# EAGLE design IMU_BNO055+BMP280_ui (EAGLE 9.6.2)
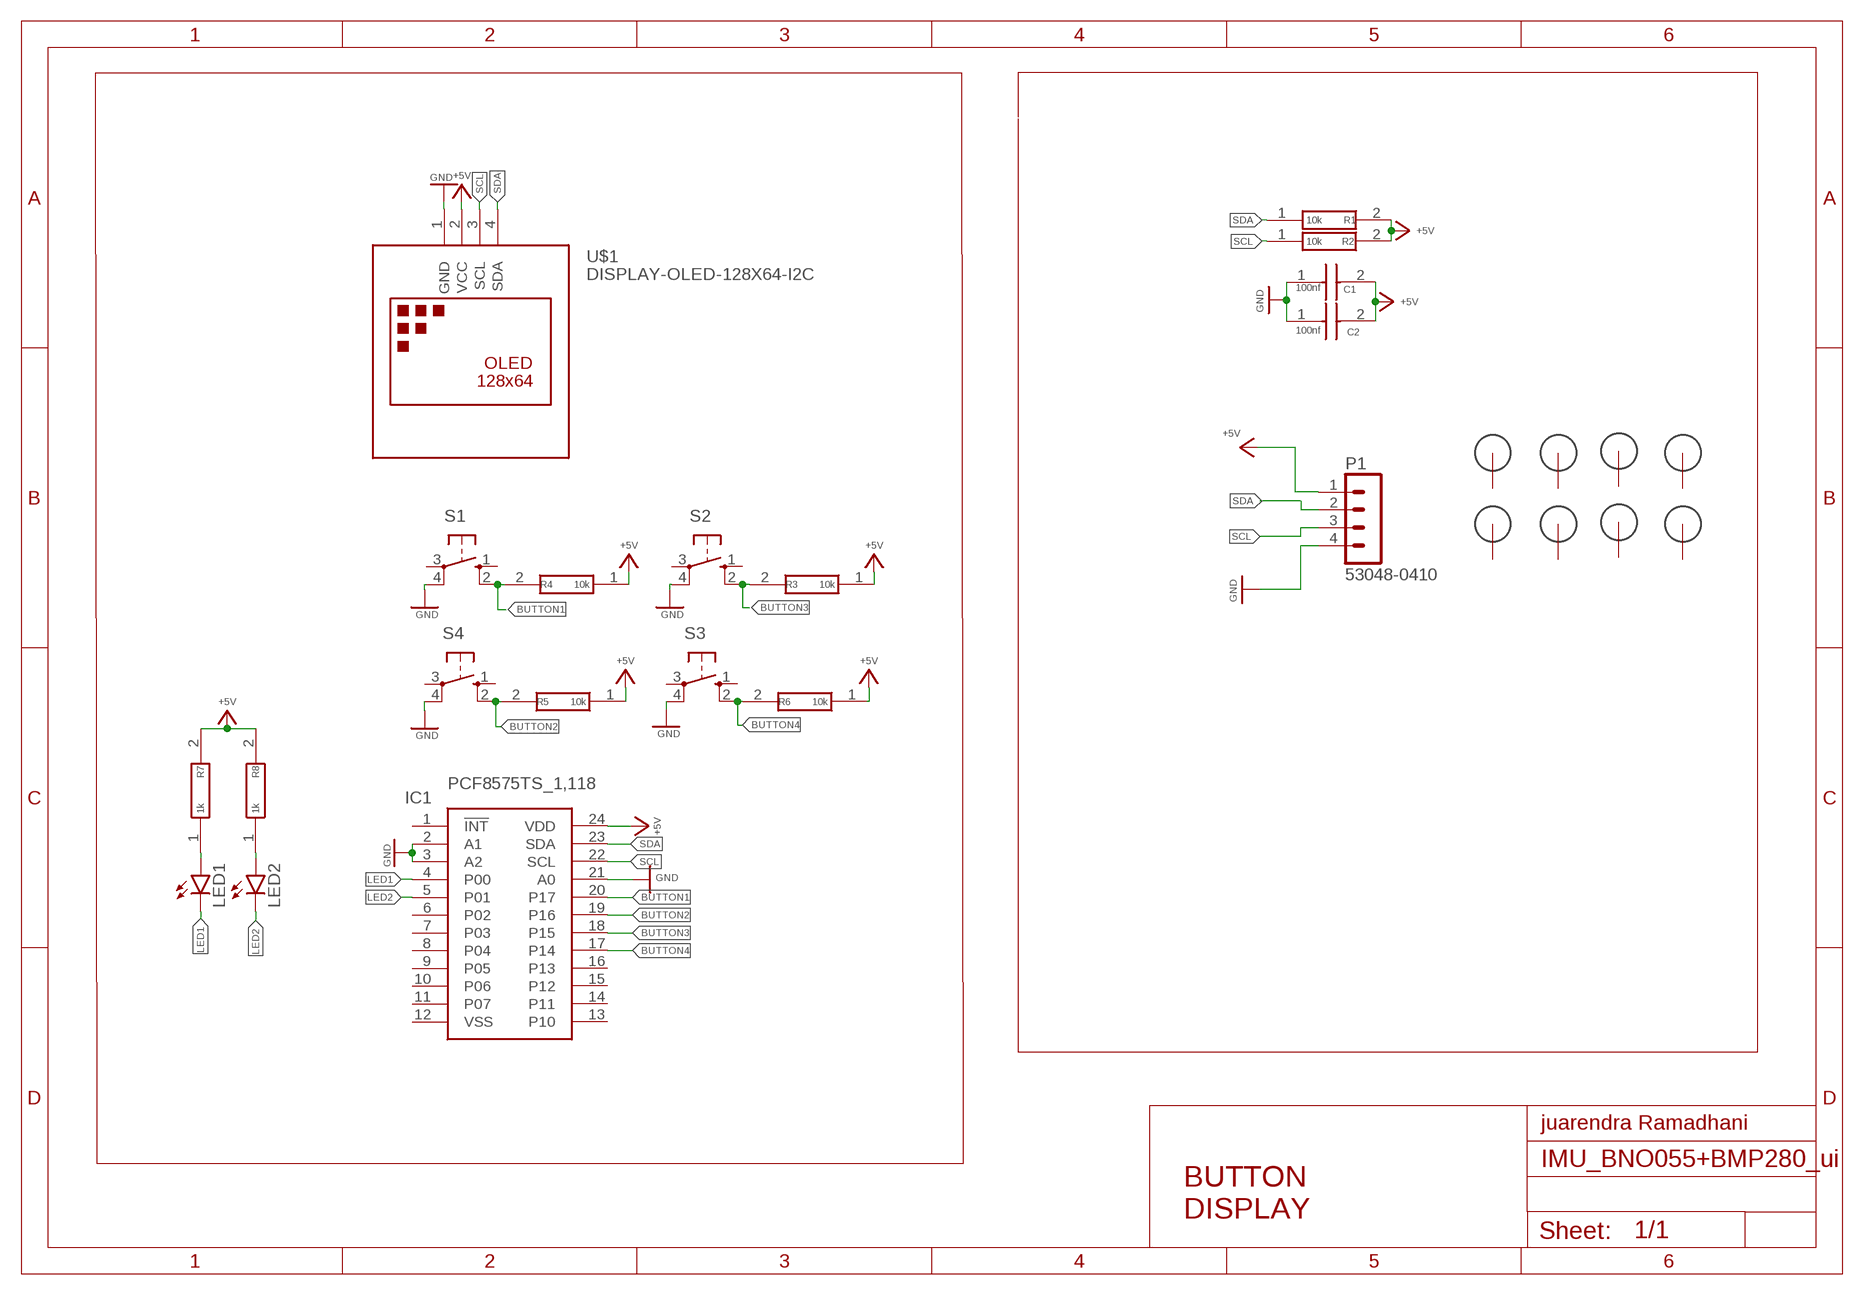
[diagram p0: schematic, sheet 1]

## Parts
C1  100nf  885012206071  [CAPC1608X87N]
C2  100nf  885012206071  [CAPC1608X87N]
H1  3MM_HOLE  [3MM_HOLE]
H2  3MM_HOLE  [3MM_HOLE]
H3  3MM_HOLE  [3MM_HOLE]
H4  3MM_HOLE  [3MM_HOLE]
H5  3MM_HOLE  [3MM_HOLE]
H6  3MM_HOLE  [3MM_HOLE]
H7  3MM_HOLE  [3MM_HOLE]
H8  3MM_HOLE  [3MM_HOLE]
IC1  PCF8575TS_1,118  [SOP65P775X200-24N]
LED1  LED3MM  [LED3MM]
LED2  LED3MM  [LED3MM]
P1  53048-0410  [53048-0410]
R1  10k  ESR03EZPJ103  [RESC1608X55N]
R2  10k  ESR03EZPJ103  [RESC1608X55N]
R3  10k  ESR03EZPJ103  [RESC1608X55N]
R4  10k  ESR03EZPJ103  [RESC1608X55N]
R5  10k  ESR03EZPJ103  [RESC1608X55N]
R6  10k  ESR03EZPJ103  [RESC1608X55N]
R7  1k  ESR03EZPJ102  [RESC1608X55N]
R8  1k  ESR03EZPJ102  [RESC1608X55N]
S1  10-XX  [B3F-10XX]
S2  10-XX  [B3F-10XX]
S3  10-XX  [B3F-10XX]
S4  10-XX  [B3F-10XX]
U$1  DISPLAY-OLED-128X64-I2C  [DISPLAY-OLED-128X64-I2C]

## Nets
+5V: C1.2 C2.2 IC1.24(VDD) P1.1 R1.2 R2.2 R3.1 R4.1 R5.1 R6.1 R7.2 R8.2 U$1.2(VCC)
BUTTON1: IC1.20(P17) R4.2 S1.2(S1)
BUTTON2: IC1.19(P16) R5.2 S4.2(S1)
BUTTON3: IC1.18(P15) R3.2 S2.2(S1)
BUTTON4: IC1.17(P14) R6.2 S3.2(S1)
GND: C1.1 C2.1 IC1.2(A1) IC1.3(A2) IC1.21(A0) P1.4 S1.4(P1) S2.4(P1) S3.4(P1) S4.4(P1) U$1.1(GND)
LED1: IC1.4(P00) LED1.K(C)
LED2: IC1.5(P01) LED2.K(C)
N$1: LED1.A R7.1
N$2: LED2.A R8.1
SCL: IC1.22(SCL) P1.3 R2.1 U$1.3(SCL)
SDA: IC1.23(SDA) P1.2 R1.1 U$1.4(SDA)
Unconnected: H1.P$1(GND) H1.P$2(GND) H1.P$3(GND) H1.P$4(GND) H1.P$5(GND) H1.P$6(GND) H1.P$7(GND) H1.P$8(GND) H1.P$9(GND) H2.P$1(GND) H2.P$2(GND) H2.P$3(GND) H2.P$4(GND) H2.P$5(GND) H2.P$6(GND) H2.P$7(GND) H2.P$8(GND) H2.P$9(GND) H3.P$1(GND) H3.P$2(GND) H3.P$3(GND) H3.P$4(GND) H3.P$5(GND) H3.P$6(GND) H3.P$7(GND) H3.P$8(GND) H3.P$9(GND) H4.P$1(GND) H4.P$2(GND) H4.P$3(GND) H4.P$4(GND) H4.P$5(GND) H4.P$6(GND) H4.P$7(GND) H4.P$8(GND) H4.P$9(GND) H5.P$1(GND) H5.P$2(GND) H5.P$3(GND) H5.P$4(GND) H5.P$5(GND) H5.P$6(GND) H5.P$7(GND) H5.P$8(GND) H5.P$9(GND) H6.P$1(GND) H6.P$2(GND) H6.P$3(GND) H6.P$4(GND) H6.P$5(GND) H6.P$6(GND) H6.P$7(GND) H6.P$8(GND) H6.P$9(GND) H7.P$1(GND) H7.P$2(GND) H7.P$3(GND) H7.P$4(GND) H7.P$5(GND) H7.P$6(GND) H7.P$7(GND) H7.P$8(GND) H7.P$9(GND) H8.P$1(GND) H8.P$2(GND) H8.P$3(GND) H8.P$4(GND) H8.P$5(GND) H8.P$6(GND) H8.P$7(GND) H8.P$8(GND) H8.P$9(GND) IC1.1(!INT) IC1.6(P02) IC1.7(P03) IC1.8(P04) IC1.9(P05) IC1.10(P06) IC1.11(P07) IC1.12(VSS) IC1.13(P10) IC1.14(P11) IC1.15(P12) IC1.16(P13) S1.1(S) S1.3(P) S2.1(S) S2.3(P) S3.1(S) S3.3(P) S4.1(S) S4.3(P)

## Notes on the sheet
- juarendra Ramadhani
- BUTTON 
  DISPLAY

## Library data of the parts
C1 C2 = AccesControlNFC:885012206071: Wurth Elektronik 0603 WCAP-CSGP 100nF Ceramic Multilayer Capacitor, 25 V dc, +125C, X7R Dielectric, +/-10% Source: Datasheet <https://katalog.we-online.com/pbs/datasheet/885012206071.pdf>; DESCRIPTION: Wurth Elektronik 0603 WCAP-CSGP 100nF Ceramic Multilayer Capacitor, 25 V dc, +125C, X7R Dielectric, +/-10%; DIGIKEY_PARTNUMBER: 732-7989-1-ND; DIGIKEY_PRICE-STOCK: https://www.digikey.com/product-detail/en/w%C3%BCrth-elektronik/885012206071/732-7989-1-ND/5454616; HEIGHT: 0.87mm; MANUFACTURER_NAME: Wurth Elektronik; MANUFACTURER_PART_NUMBER: 885012206071; MOUSER_PART_NUMBER: 710-885012206071; MOUSER_PRICE-STOCK: https://www.mouser.co.uk/ProductDetail/Wurth-Elektronik/885012206071?qs=0KOYDY2FL2%2FEBQkuHgvarg%3D%3D
H1-H8 = 3mm_special_hole:3MM_HOLE: Cool looking 3mm hole with ground connection
IC1 = Raritan Digital IO:PCF8575TS_1,118: Interface - I/O Expanders Source: Datasheet <http://www.nxp.com/docs/en/data-sheet/PCF8575C.pdf>; DESCRIPTION: Interface - I/O Expanders; HEIGHT: 2mm; MANUFACTURER_NAME: NXP; MANUFACTURER_PART_NUMBER: PCF8575TS/1,118; MOUSER_PART_NUMBER: 771-PCF8575TSDB-T; MOUSER_PRICE-STOCK: https://www.mouser.co.uk/ProductDetail/NXP-Semiconductors/PCF8575TS-1118?qs=LOCUfHb8d9vMl26vh33NWQ%3D%3D
LED1 LED2 = led:LED: LED OSRAM: - CHIPLED LG R971, LG N971, LY N971, LG Q971, LY Q971, LO R971, LY R971 LH N974, LH R974 LS Q976, LO Q976, LY Q976 LO Q996 - Hyper CHIPLED LW Q18S LB Q993, LB Q99A, LB R99A - SideLED LS A670, LO A670, LY A670, LG A670, LP A670 LB A673, LV A673, LT A673, LW A673 LH A674 LY A675 LS A676, LA A676, LO A676, LY A676, LW A676 LS A679, LY A679, LG A679 - Hyper Micro SIDELED® LS Y876, LA Y876, LO Y876, LY Y876 LT Y87S - SmartLED LW L88C, LW L88S LB L89C, LB L89S, LG L890 LS L89K, LO L89K, LY L89K LS L896, LA L896, LO L896, LY L896 - TOPLED LS T670, LO T670, LY T670, LG T670, LP T670 LSG T670, LSP T670, LSY T670, LOP T670, LYG T670 LG T671, LOG T671, LSG T671 LB T673, LV T673, LT T673, LW T673 LH T674 LS T676, LA T676, LO T676, LY T676, LB T676, LH T676, LSB T676, LW T676 LB T67C, LV T67C, LT T67C, LS T67K, LO T67K, LY T67K, LW E67C LS E67B, LA E67B, LO E67B, LY E67B, LB E67C, LV E67C, LT E67C LW T67C LS T679, LY T679, LG T679 LS T770, LO T770, LY T770, LG T770, LP T770 LB T773, LV T773, LT T773, LW T773 LH T774 LS E675, LA E675, LY E675, LS T675 LS T776, LA T776, LO T776, LY T776, LB T776 LHGB T686 LT T68C, LB T68C - Hyper Mini TOPLED® LB M676 - Mini TOPLED Santana® LG M470 LS M47K, LO M47K, LY M47K Source: http://www.osram.convergy.de LUXEON: - LUMILED® LXK2-PW12-R00, LXK2-PW12-S00, LXK2-PW14-U00, LXK2-PW14-V00 LXK2-PM12-R00, LXK2-PM12-S00, LXK2-PM14-U00 LXK2-PE12-Q00, LXK2-PE12-R00, LXK2-PE12-S00, LXK2-PE14-T00, LXK2-PE14-U00 LXK2-PB12-K00, LXK2-PB12-L00, LXK2-PB12-M00, LXK2-PB14-N00, LXK2-PB14-P00, LXK2-PB14-Q00 LXK2-PR12-L00, LXK2-PR12-M00, LXK2-PR14-Q00, LXK2-PR14-R00 LXK2-PD12-Q00, LXK2-PD12-R00, LXK2-PD12-S00 LXK2-PH12-R00, LXK2-PH12-S00 LXK2-PL12-P00, LXK2-PL12-Q00, LXK2-PL12-R00 Source: www.luxeon.com KINGBRIGHT: KA-3528ASYC Source: www.kingbright.com
P1 = 53048-0410:53048-0410: HEADER Check availability <https://pricing.snapeda.com/parts/53048-0410/Molex/view-part?ref=eda>; AVAILABILITY: In Stock; CHECK_PRICES: https://www.snapeda.com/parts/53048-0410/Molex/view-part/?ref=eda; DESCRIPTION: 4 way through board PCB 90deg header | Molex Incorporated 53048-0410; MF: Molex; MP: 53048-0410; PACKAGE: None; PRICE: None; SNAPEDA_LINK: https://www.snapeda.com/parts/53048-0410/Molex/view-part/?ref=snap
R1-R6 = AccesControlNFC:ESR03EZPJ103: Thick Film Resistors - SMD 0603 10Kohm 5% Anti Surge AEC-Q200 Source: Datasheet <https://componentsearchengine.com/Datasheets/1/ESR03EZPJ103.pdf>; DESCRIPTION: Thick Film Resistors - SMD 0603 10Kohm 5% Anti Surge AEC-Q200; DIGIKEY_PARTNUMBER: RHM10KDCT-ND; DIGIKEY_PRICE-STOCK: https://www.digikey.com/product-detail/en/rohm-semiconductor/ESR03EZPJ103/RHM10KDCT-ND/1762925; HEIGHT: 0.55mm; MANUFACTURER_NAME: ROHM Semiconductor; MANUFACTURER_PART_NUMBER: ESR03EZPJ103; MOUSER_PART_NUMBER: 755-ESR03EZPJ103; MOUSER_PRICE-STOCK: https://www.mouser.com/Search/Refine.aspx?Keyword=755-ESR03EZPJ103
R7 R8 = AccesControlNFC:ESR03EZPJ102: Thick Film Resistors - SMD 0603 1Kohm 5% Anti Surge AEC-Q200 Source: Datasheet <http://www.rohm.com/web/global/datasheet/ESR01MZPF/esr-e>; DESCRIPTION: Thick Film Resistors - SMD 0603 1Kohm 5% Anti Surge AEC-Q200; DIGIKEY_PARTNUMBER: RHM1.0KDCT-ND; DIGIKEY_PRICE-STOCK: https://www.digikey.com/product-detail/en/rohm-semiconductor/ESR03EZPJ102/RHM1-0KDCT-ND/1762924; HEIGHT: 0.55mm; MANUFACTURER_NAME: ROHM Semiconductor; MANUFACTURER_PART_NUMBER: ESR03EZPJ102; MOUSER_PART_NUMBER: 755-ESR03EZPJ102; MOUSER_PRICE-STOCK: https://www.mouser.co.uk/ProductDetail/ROHM-Semiconductor/ESR03EZPJ102?qs=DyUWGjl%252BcVvjMuV%252BzioV7Q%3D%3D
S1-S4 = switch-omron:10-XX: OMRON SWITCH; MPN: B3F-1000; OC_FARNELL: 176432; OC_NEWARK: 36M3542
U$1 = diy-modules:DISPLAY-OLED-128X64-I2C: 128x64 Dot Matrix OLED Module based on SSD1306 chip Variant with I2C interface More details available here: http://www.instructables.com/id/Monochrome-096-i2c-OLED-display-with-arduino-SSD13/ SSD1306 datasheet: https://cdn-shop.adafruit.com/datasheets/SSD1306.pdf Click here to find device on ebay.com <http://www.ebay.com/sch/oled+display+128x64+iic> Note: There are two variants: I2C and SPI. Search for the proper version.

## Net classes
1 highpower: width 0.406 mm, drill 0.483 mm

## Board
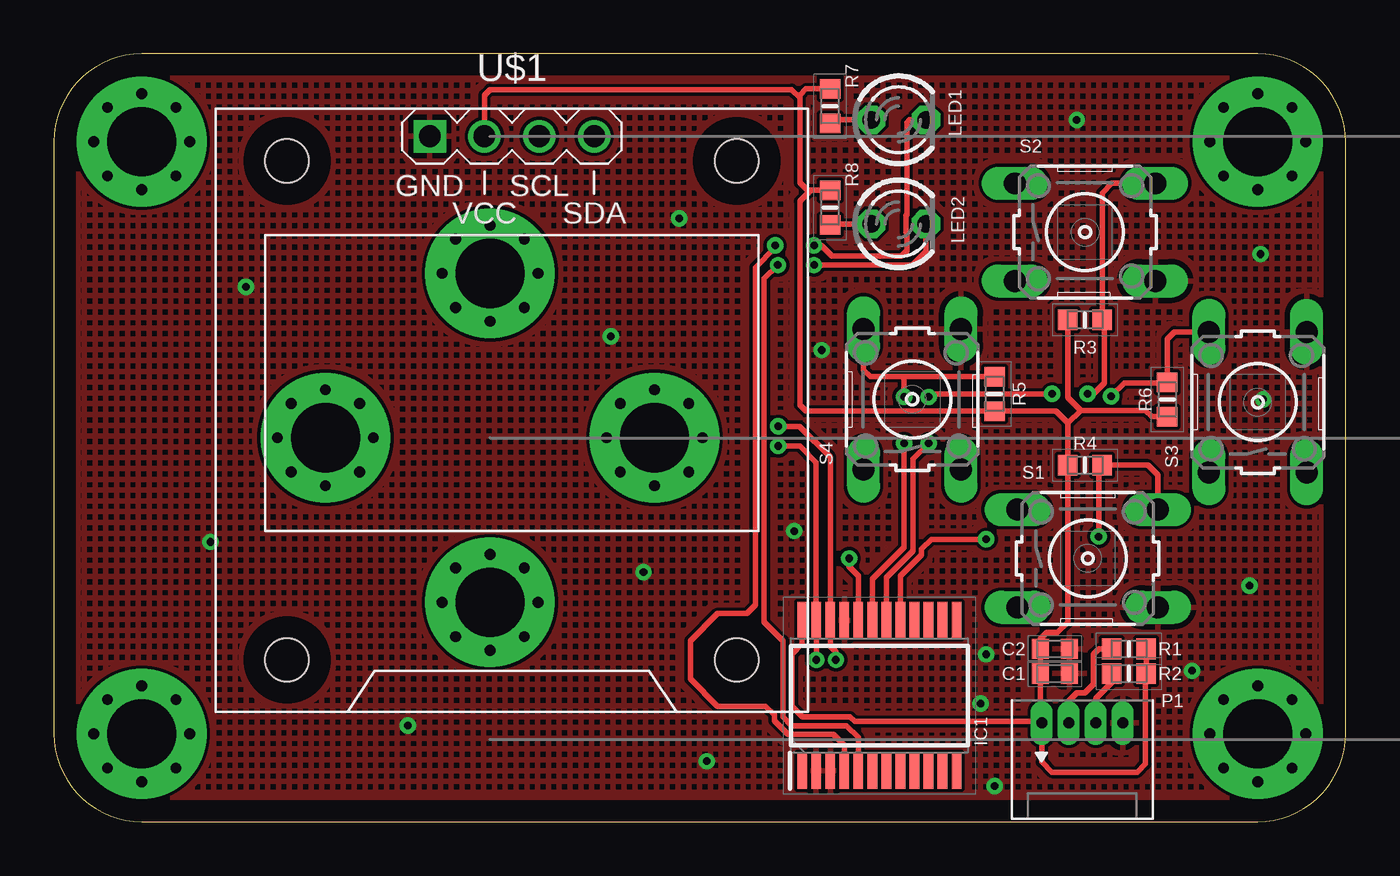
[diagram p1: board, top side]
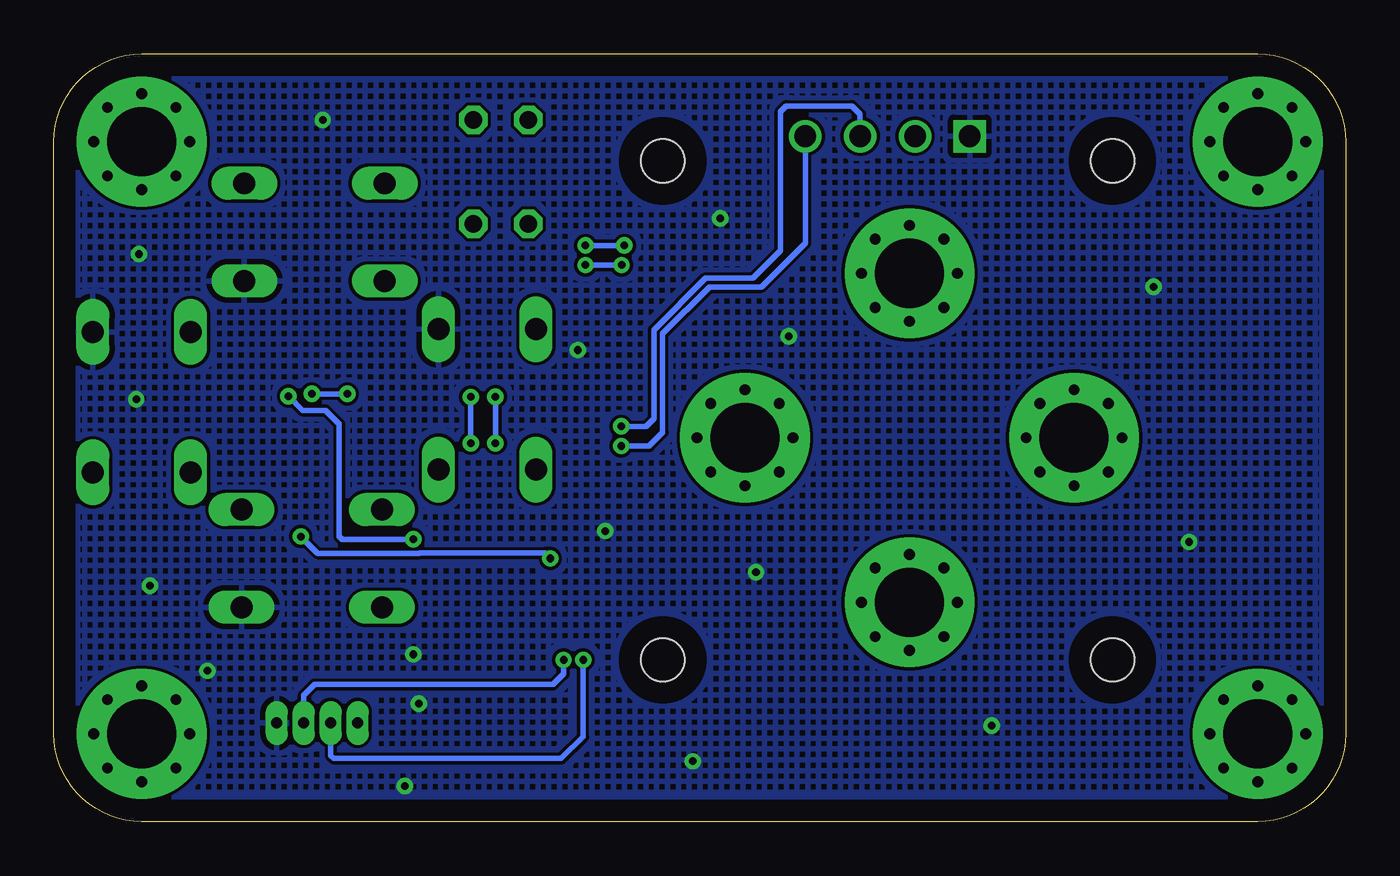
[diagram p2: board, bottom side, seen from below]

Size 59.82 x 35.56 mm. Coordinates in mm from the lower left corner, seen from the top.
Outline: 0,31.5 0,4.06 arc90 4.06,0 55.75,0 arc90 59.82,4.06 59.82,31.5 arc90 55.75,35.56 4.06,35.56 arc90 0,31.5
Copper layers (1*16): Top 0.035mm / dielectric 1.5mm / Bottom 0.035mm
Design rules "default *": minimum track width 6mil, minimum drill 0.35mm, track to track 6mil, track to pad 6mil, pad to pad 6mil, via to via 6mil, smd to smd 6mil, copper to edge 40mil, drill to drill 6mil, minimum pad ring 10mil, minimum via ring 8mil, stop-mask expansion 4mil, vias tented up to drill 0.36mm, thermal gap 10mil

### Footprints (pad centres in the part's own frame; a part is rotated, then mirrored left to right if it is on the bottom)
CAPC1608X87N = smd 0.8 x 0.94: 1 -0.67,0; 2 0.67,0
3MM_HOLE = drill 3.2 pad 6: P$1 0,0 | drill 0.5 pad 0.61: P$2 0,2.223; P$3 0,-2.223; P$4 2.223,0; P$5 -2.223,0; P$6 -1.587,1.587; P$7 1.587,1.587; P$8 1.587,-1.587; P$9 -1.587,-1.587
SOP65P775X200-24N = smd 1.675 x 0.45: 1 -3.488,3.575; 2 -3.488,2.925; 3 -3.488,2.275; 4 -3.488,1.625; 5 -3.488,0.975; 6 -3.488,0.325; 7 -3.488,-0.325; 8 -3.488,-0.975; 9 -3.488,-1.625; 10 -3.488,-2.275; 11 -3.488,-2.925; 12 -3.488,-3.575; 13 3.488,-3.575; 14 3.488,-2.925; 15 3.488,-2.275; 16 3.488,-1.625; 17 3.488,-0.975; 18 3.488,-0.325; 19 3.488,0.325; 20 3.488,0.975; 21 3.488,1.625; 22 3.488,2.275; 23 3.488,2.925; 24 3.488,3.575
LED3MM = drill 0.813 octagon: A -1.27,0; K 1.27,0
53048-0410 = drill 0.508 long: 1 -1.875,0; 2 -0.625,0; 3 0.625,0; 4 1.875,0
RESC1608X55N = smd 0.9 x 0.95: 1 -0.8,0; 2 0.8,0
B3F-10XX = drill 1.016 long: 1 -3.251,2.261; 2 3.251,2.261; 3 -3.251,-2.261; 4 3.251,-2.261
DISPLAY-OLED-128X64-I2C = drill 1 square: 1 -3.81,12.7 | drill 1: 2 -1.27,12.7; 3 1.27,12.7; 4 3.81,12.7 | hole 2: -10.414,11.557; 10.414,11.557; 10.414,-11.557; -10.414,-11.557

### Placement (x,y rotation side)
C1  46.35,6.86 180 top
C2  46.35,8 180 top
H1  20.19,10.16 0 top
H2  27.81,17.78 0 top
H3  20.19,25.4 0 top
H4  12.57,17.78 0 top
H5  4.06,4.06 0 top
H6  55.75,4.06 0 top
H7  4.06,31.5 0 top
H8  55.75,31.5 0 top
IC1  38.23,5.84 90 top
LED1  39.12,32.51 0 top
LED2  39.12,27.69 0 top
P1  47.62,4.57 0 top
R1  49.78,8 0 top
R2  49.78,6.86 0 top
R3  47.75,23.24 0 top
R4  47.75,16.51 0 top
R5  43.56,19.81 90 top
R6  51.56,19.56 90 top
R7  35.94,33.15 90 top
R8  35.94,28.45 90 top
S1  47.88,12.19 0 top
S2  47.75,27.3 0 top
S3  55.75,19.43 90 top
S4  39.75,19.56 90 top
U$1  21.21,19.05 0 top

### Tracks (layer width: path | path; a pad name or v marks a point on that pad's centre or on a via)
+5V
  Top 0.254: R1.2 R2.2 50.55,6.82 50.55,2.67 50.16,2.29 46.23,2.29 45.75,2.76 P1.1 45.68,4.64 | 45.68,4.64 C1.2 C2.2 45.68,8.47 45.97,8.76 46.48,8.76 46.95,9.23 R4.1 46.95,18.45 | R8.2 35.05,29.25 | 35.05,29.25 34.89,29.25 34.54,29.59 34.54,33.53 | 34.54,33.53 34.54,33.66 34.84,33.95 R7.2 | 35.05,29.25 34.54,28.74 34.54,19.3 34.84,19.01 R5.1 46.39,19.01 46.95,18.45 | 46.95,18.45 47.55,19.05 | 47.55,19.05 50.55,19.05 50.84,18.76 R6.1 | R3.1 46.95,19.65 47.55,19.05 | U$1.2 19.94,33.66 20.19,33.91 34.16,33.91 34.54,33.53 | IC1.24 34.65,8.24 34.17,7.76 34.17,5.35 34.67,4.85 36.87,4.85 37.09,4.64 45.68,4.64
BUTTON1  (via drill 0.35)
  Top 0.254: S1.2 51.13,16.05 50.67,16.51 R4.2 48.39,16.34 v48.39,13.21 | v36.83,12.19 36.83,11.81 37.25,11.39 IC1.20
  Bottom 0.254: v48.39,13.21 47.6,12.42 42.91,12.42 42.88,12.45 37.08,12.45 v36.83,12.19
BUTTON2  (via drill 0.35)
  Top 0.254: R5.2 39.37,20.61 | 39.37,20.61 37.81,20.61 37.49,20.93 S4.2 | 39.37,20.61 v39.37,19.69 | v39.37,17.53 39.37,12.7 37.9,11.23 IC1.19
  Bottom 0.254: v39.37,19.69 v39.37,17.53
BUTTON3  (via drill 0.35)
  Top 0.254: S2.2 49,29.57 48.55,29.12 R3.2 48.64,23.15 48.64,20.32 48.13,19.81 v47.88,19.81 | IC1.18 38.55,11.31 39.78,12.53 39.78,16.79 v40.51,17.53 | v40.51,19.67 40.66,19.81 v46.23,19.81
  Bottom 0.254: v40.51,17.53 v40.51,19.67 | v46.23,19.81 v47.88,19.81
BUTTON4  (via drill 0.35)
  Top 0.254: S3.2 51.89,22.68 51.56,22.35 R6.2 51.52,20.32 49.57,20.32 v48.96,19.71 | v43.18,13.08 40.64,13.08 40.18,12.62 40.18,12.36 39.2,11.38 IC1.17
  Bottom 0.254: v48.96,19.71 48.3,19.05 47.24,19.05 46.61,18.41 46.61,13.21 46.48,13.08 v43.18,13.08
GND  (via drill 0.35)
  other vias: 42.93,5.46 52.71,6.98 43.56,1.65 43.18,7.75 30.23,2.79 27.3,11.56 34.29,13.46 35.56,21.84 25.78,22.48 28.96,27.94 8.89,24.77 7.24,12.95 16.38,4.45 55.37,10.92 56.01,19.56 55.88,26.29 47.37,32.51
  pour Bottom (hatched): 2.29,35.81 57.02,35.81 59.69,33.15 59.69,9.14 59.7,9.14 59.56,2.16 57.4,0 2.41,0 -0.13,2.54 -0.13,33.4
  pour Top (hatched): 2.41,35.56 57.4,35.56 59.69,33.27 59.69,26.8 59.56,8.76 59.69,8.76 59.69,2.29 57.4,0 2.41,0 -0.13,2.54 -0.13,33.02
LED1  (via drill 0.35)
  Top 0.254: IC1.4 36.6,3.53 36.09,4.04 33.99,4.04 33.36,4.67 33.36,4.95 32.96,5.35 30.73,5.35 29.48,6.6 29.48,8.38 30.73,9.64 32.09,9.64 32.49,10.03 32.49,25.67 33.4,26.58 v33.4,26.69 | v35.2,26.69 35.54,26.69 36.04,26.19 39.24,26.19 39.5,26.44 39.5,27.25 39.45,27.3 39.45,28.08 39.5,28.13 39.5,32.39 39.62,32.51 LED1.K
  Bottom 0.254: v33.4,26.69 v35.2,26.69
LED2  (via drill 0.35)
  Top 0.254: LED2.K 40.39,26.42 39.75,25.78 v35.2,25.78 | v33.53,25.78 32.89,25.15 32.89,9.25 33.77,8.38 33.77,4.84 34.16,4.45 36.7,4.45 37.25,3.9 IC1.5
  Bottom 0.254: v35.2,25.78 v33.53,25.78
N$1
  Top 0.254: R7.1 36.11,32.51 LED1.A
N$2
  Top 0.254: R8.1 35.98,27.69 LED2.A
SCL  (via drill 0.35)
  Top 0.254: P1.3 48.25,5.7 48.98,6.44 R2.1 | v36.21,7.49 36.21,7.85 35.95,8.12 IC1.22 35.95,16.88 34.52,18.31 v33.55,18.31
  Bottom 0.254: P1.3 48.25,5.85 47.75,6.35 36.7,6.35 36.21,6.84 v36.21,7.49 | v33.55,18.31 32.39,18.31 32.03,18.67 32.03,22.77 29.63,25.17 27.43,25.17 26.16,26.44 26.16,32.89 25.91,33.15 22.86,33.15 22.48,32.77 U$1.3
SDA  (via drill 0.35)
  Top 0.254: P1.2 47,5.6 47.37,5.97 47.75,5.97 48.13,6.35 48.13,7.75 48.39,8 R1.1 | v35.31,7.49 IC1.23 35.3,16.64 34.54,17.4 v33.55,17.4
  Bottom 0.254: P1.2 47,3.06 46.86,2.92 36.32,2.92 35.31,3.94 v35.31,7.49 | v33.55,17.4 32.26,17.4 31.62,18.03 31.62,22.61 29.46,24.77 27.05,24.77 25.02,26.8 U$1.4